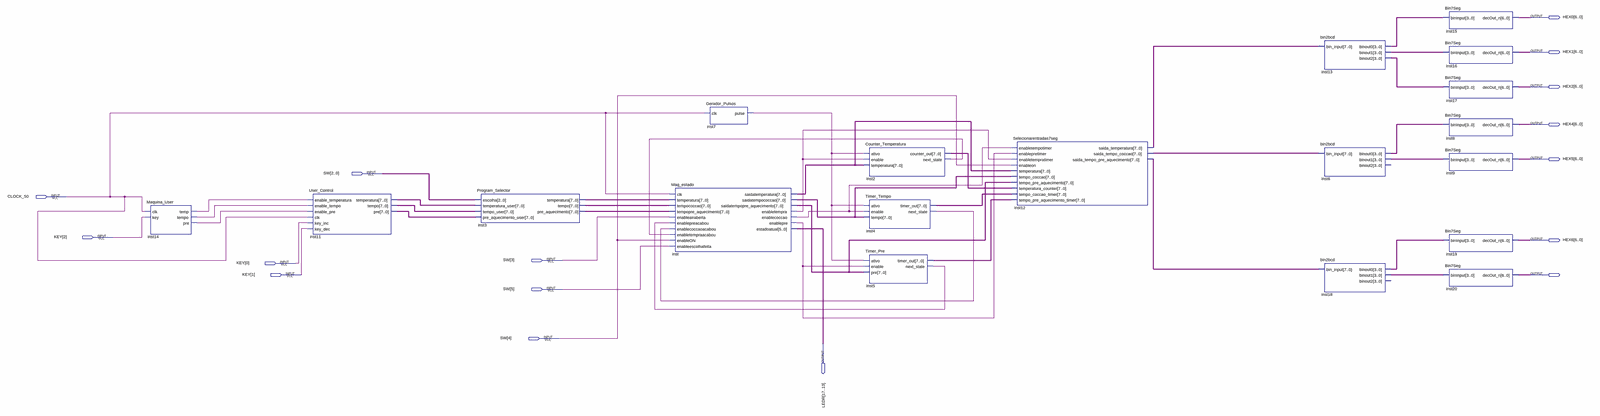
[diagram p0: schematic sheet, whole]
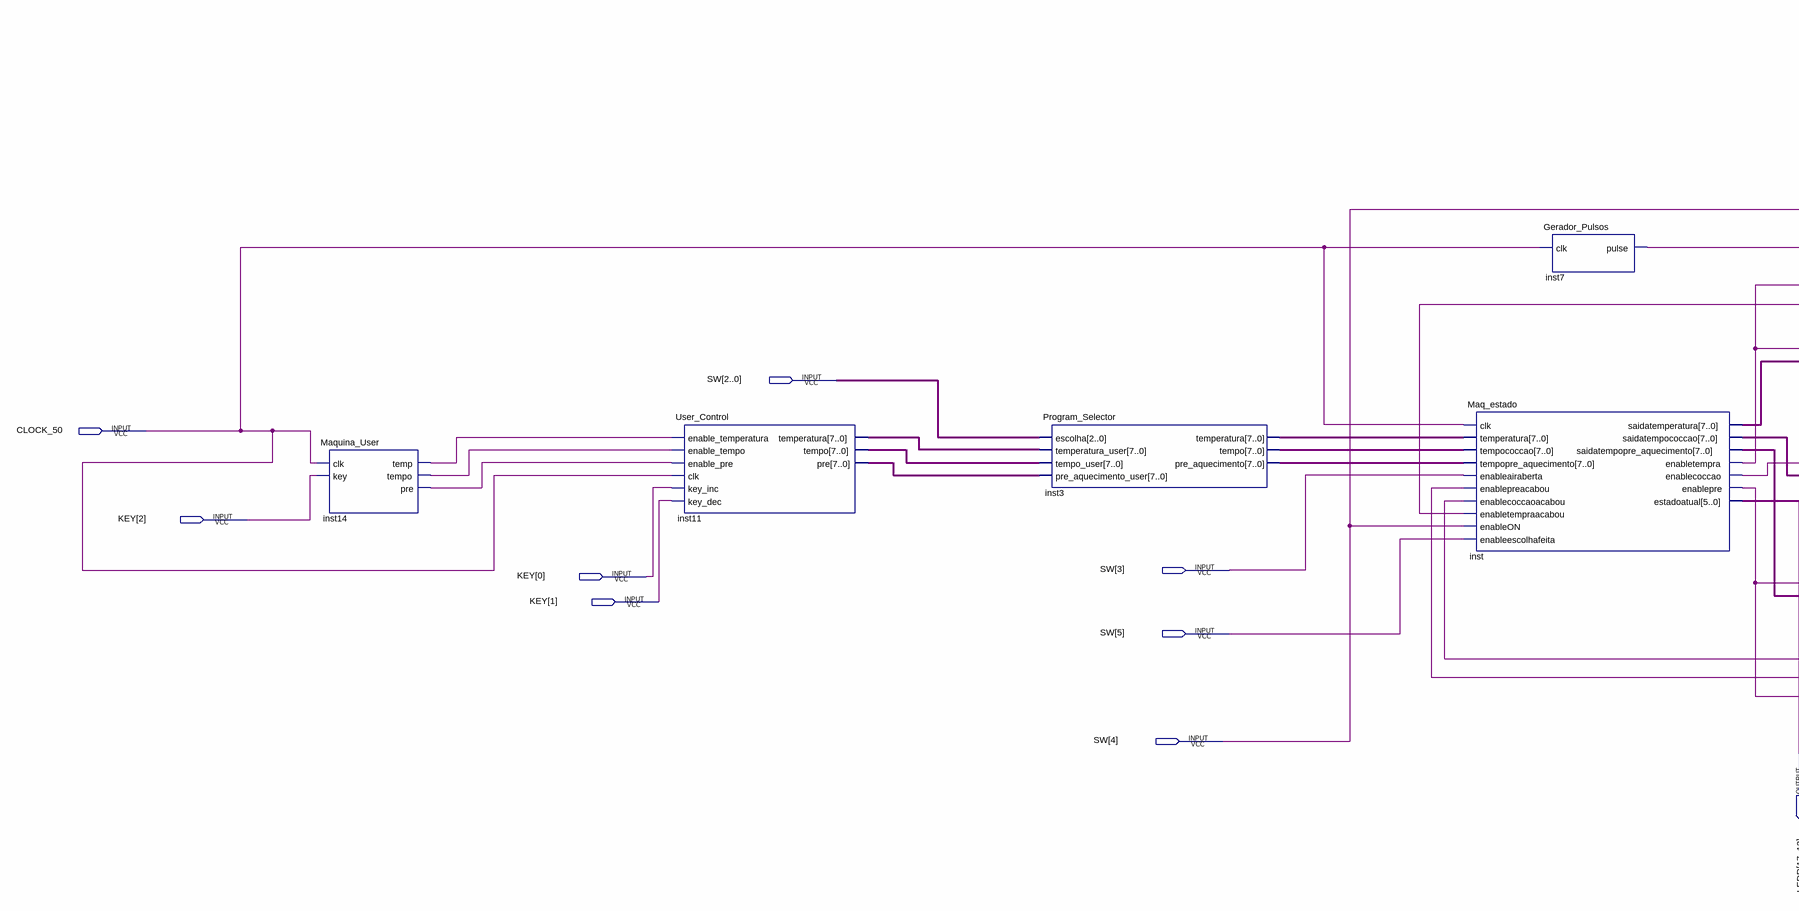
[diagram p1: schematic sheet, left part]
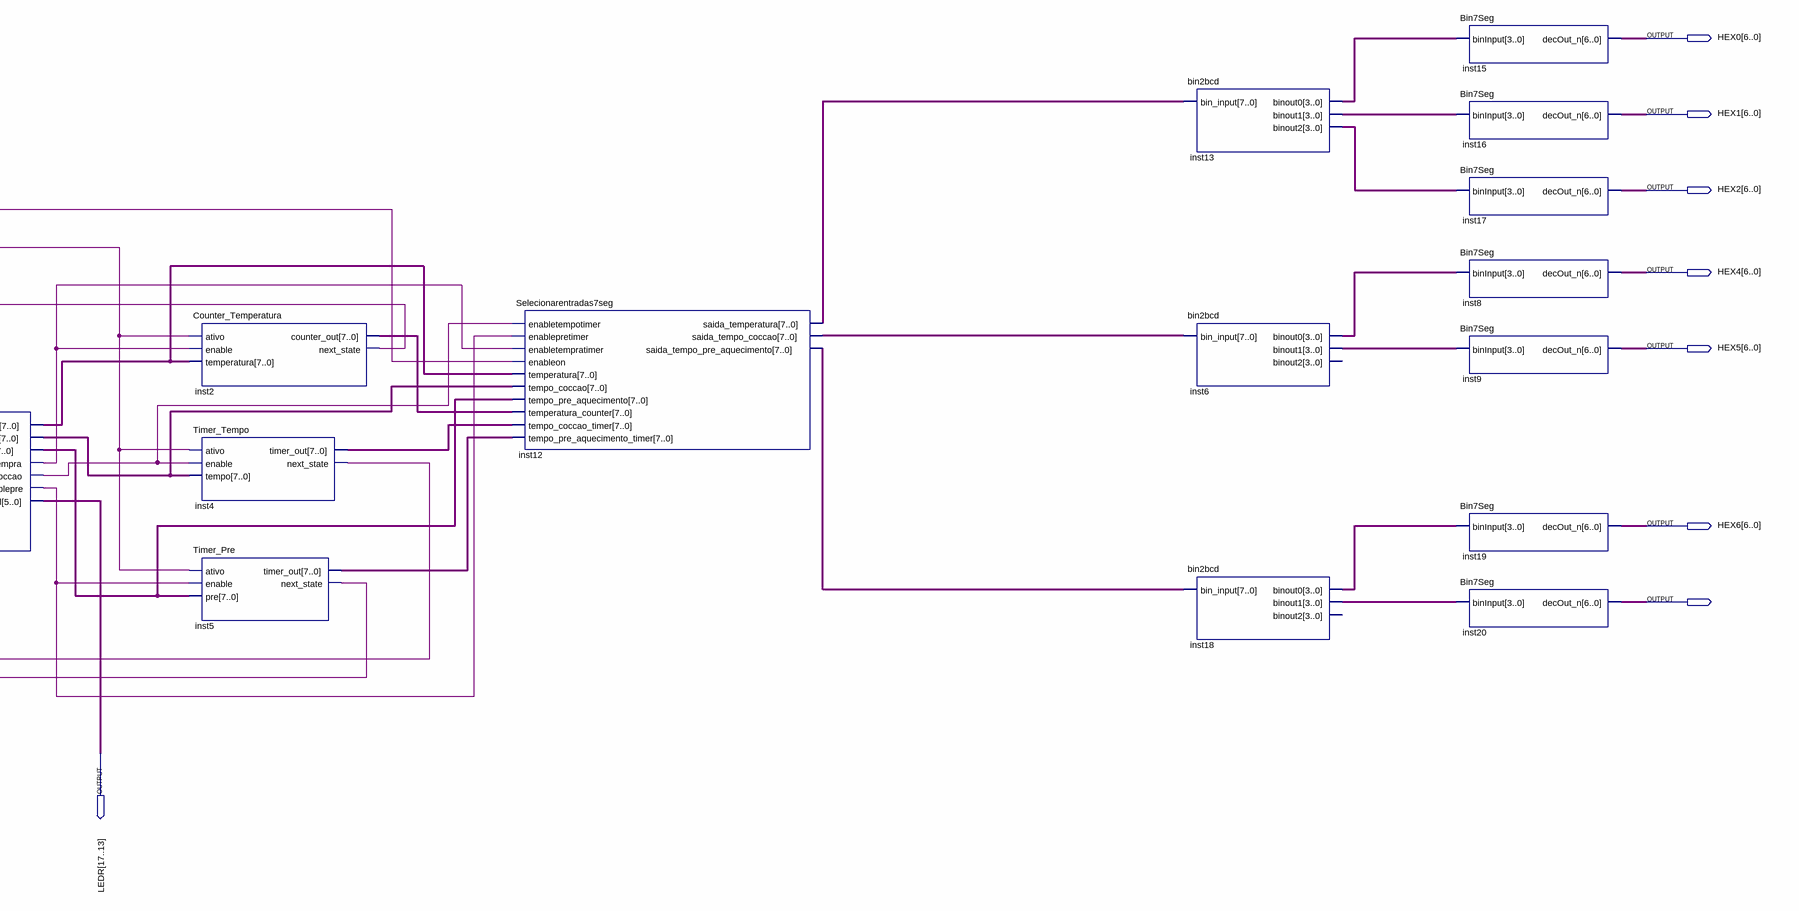
[diagram p2: schematic sheet, right part]
// Quartus schematic maq_estados full.bdf as structural Verilog: 19 symbols, 16 pins
module \maq_estados_full  (
  input  [5:0] SW,
  input  CLOCK_50,
  input  [2:0] KEY,
  output [6:0] HEX0,
  output [6:0] HEX1,
  output [6:0] HEX2,
  output [6:0] HEX4,
  output [6:0] HEX5,
  output [6:0] HEX6,
  output [17:13] LEDR
);

  wire inst2_next_state, inst4_next_state, inst5_next_state, inst7_pulse, inst14_pre, inst14_temp,
       inst14_tempo, inst_enablecoccao, inst_enablepre, inst_enabletempra;
  wire [3:0] inst6_binout0, inst6_binout1, inst13_binout0, inst13_binout1, inst13_binout2, inst18_binout0,
       inst18_binout1;
  wire [6:0] inst20_decout_n;
  wire [7:0] inst2_counter_out, inst3_pre_aquecimento, inst3_temperatura, inst3_tempo, inst4_timer_out,
       inst5_timer_out, inst11_pre, inst11_temperatura, inst11_tempo, inst12_saida_temperatura,
       inst12_saida_tempo_coccao, inst12_saida_tempo_pre_aquecimento, inst_saidatemperatura,
       inst_saidatempococcao, inst_saidatempopre_aquecimento;

  Maquina_User inst14 (.clk(CLOCK_50), .key(KEY[2]), .temp(inst14_temp), .tempo(inst14_tempo), .pre(inst14_pre));
  User_Control inst11 (
    .enable_temperatura(inst14_temp), .enable_tempo(inst14_tempo), .enable_pre(inst14_pre), .clk(CLOCK_50),
    .key_inc(KEY[0]), .key_dec(KEY[1]), .temperatura(inst11_temperatura), .tempo(inst11_tempo),
    .pre(inst11_pre));
  Program_Selector inst3 (
    .escolha(SW[2:0]), .temperatura_user(inst11_temperatura), .tempo_user(inst11_tempo),
    .pre_aquecimento_user(inst11_pre), .temperatura(inst3_temperatura), .tempo(inst3_tempo),
    .pre_aquecimento(inst3_pre_aquecimento));
  Maq_estado inst (
    .clk(CLOCK_50), .temperatura(inst3_temperatura), .tempococcao(inst3_tempo),
    .tempopre_aquecimento(inst3_pre_aquecimento), .enableairaberta(SW[3]),
    .enablepreacabou(inst5_next_state), .enablecoccaoacabou(inst4_next_state),
    .enabletempraacabou(inst2_next_state), .enableON(SW[4]), .enableescolhafeita(SW[5]),
    .saidatemperatura(inst_saidatemperatura), .saidatempococcao(inst_saidatempococcao),
    .saidatempopre_aquecimento(inst_saidatempopre_aquecimento), .enabletempra(inst_enabletempra),
    .enablecoccao(inst_enablecoccao), .enablepre(inst_enablepre), .estadoatual(LEDR));
  Gerador_Pulsos inst7 (.clk(CLOCK_50), .pulse(inst7_pulse));
  Counter_Temperatura inst2 (
    .ativo(inst7_pulse), .enable(inst_enabletempra), .temperatura(inst_saidatemperatura),
    .counter_out(inst2_counter_out), .next_state(inst2_next_state));
  Timer_Tempo inst4 (
    .ativo(inst7_pulse), .enable(inst_enablecoccao), .tempo(inst_saidatempococcao),
    .timer_out(inst4_timer_out), .next_state(inst4_next_state));
  Timer_Pre inst5 (
    .ativo(inst7_pulse), .enable(inst_enablepre), .pre(inst_saidatempopre_aquecimento),
    .timer_out(inst5_timer_out), .next_state(inst5_next_state));
  Selecionarentradas7seg inst12 (
    .enabletempotimer(inst_enablecoccao), .enablepretimer(inst_enablepre),
    .enabletempratimer(inst_enabletempra), .enableon(SW[4]), .temperatura(inst_saidatemperatura),
    .tempo_coccao(inst_saidatempococcao), .tempo_pre_aquecimento(inst_saidatempopre_aquecimento),
    .temperatura_counter(inst2_counter_out), .tempo_coccao_timer(inst4_timer_out),
    .tempo_pre_aquecimento_timer(inst5_timer_out), .saida_temperatura(inst12_saida_temperatura),
    .saida_tempo_coccao(inst12_saida_tempo_coccao),
    .saida_tempo_pre_aquecimento(inst12_saida_tempo_pre_aquecimento));
  bin2bcd inst13 (
    .bin_input(inst12_saida_temperatura), .binout0(inst13_binout0), .binout1(inst13_binout1),
    .binout2(inst13_binout2));
  bin2bcd inst6 (
    .bin_input(inst12_saida_tempo_coccao), .binout0(inst6_binout0), .binout1(inst6_binout1));  // open: binout2
  bin2bcd inst18 (
    .bin_input(inst12_saida_tempo_pre_aquecimento), .binout0(inst18_binout0), .binout1(inst18_binout1));  // open: binout2
  Bin7Seg inst15 (.binInput(inst13_binout0), .decOut_n(HEX0));
  Bin7Seg inst16 (.binInput(inst13_binout1), .decOut_n(HEX1));
  Bin7Seg inst17 (.binInput(inst13_binout2), .decOut_n(HEX2));
  Bin7Seg inst8 (.binInput(inst6_binout0), .decOut_n(HEX4));
  Bin7Seg inst9 (.binInput(inst6_binout1), .decOut_n(HEX5));
  Bin7Seg inst19 (.binInput(inst18_binout0), .decOut_n(HEX6));
  Bin7Seg inst20 (.binInput(inst18_binout1), .decOut_n(inst20_decout_n));
endmodule
